# Altium project AMS_Remote_Module.PrjPcb
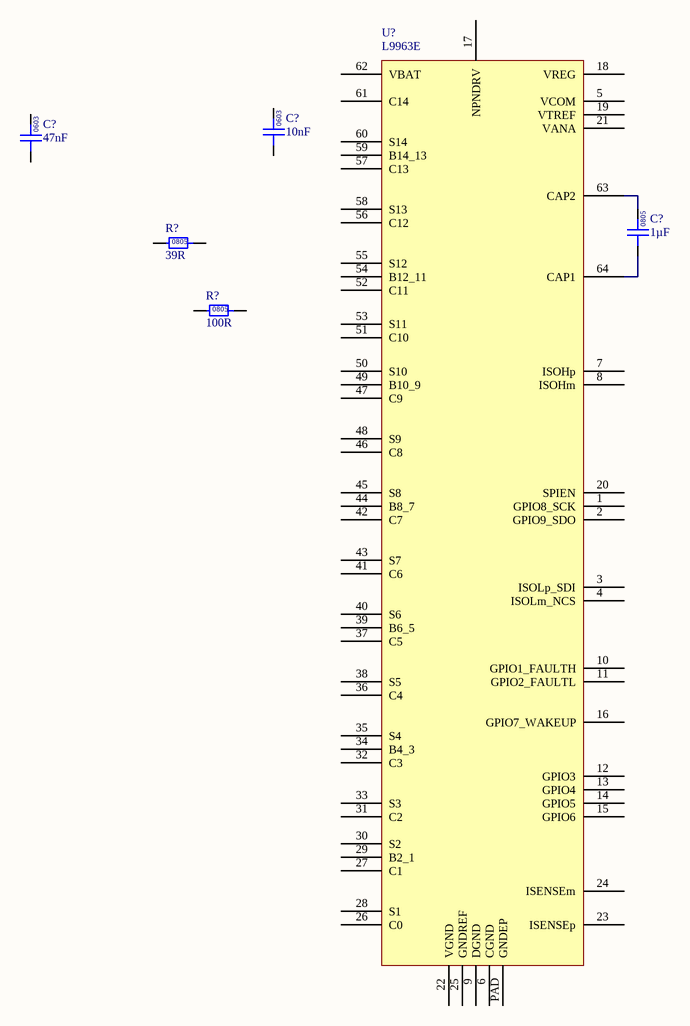
[diagram p0: L9663E.SchDoc]
1 sheet, 6 parts. Net scope: global (net labels, ports and power ports of the same name join across sheets).

## Sheet L9663E.SchDoc
size A3; SheetNumber: 1; SheetTotal: 1

### Parts
(Parts that share a designator on the sheet are numbered #1, #2 ... from top to bottom, then left to right.)
C?#1  47nF  [0603]
C?#2  10nF  [0603]
C?#3  1µF  [0805]
R?#1  39R  [0805]
R?#2  100R  [0805]
U?  L9963E  [ST_TQFP]

### Nets
NetC?#3_1: C?#3.1 U?.64(CAP1)
NetC?#3_2: C?#3.2 U?.63(CAP2)

Not connected (* = marked no-connect by the designer): C?#1 1 2; C?#2 1 2; R?#1 1 2; R?#2 1 2; U? 1(GPIO8_SCK) 2(GPIO9_SDO) 3(ISOLp_SDI) 4(ISOLm_NCS) 5(VCOM) 6(CGND) 7(ISOHp) 8(ISOHm) 9(DGND) 10(GPIO1_FAULTH) 11(GPIO2_FAULTL) 12(GPIO3) 13(GPIO4) 14(GPIO5) 15(GPIO6) 16(GPIO7_WAKEUP) 17(NPNDRV) 18(VREG) 19(VTREF) 20(SPIEN) 21(VANA) 22(VGND) 23(ISENSEp) 24(ISENSEm) 25(GNDREF) 26(C0) 27(C1) 28(S1) 29(B2_1) 30(S2) 31(C2) 32(C3) 33(S3) 34(B4_3) 35(S4) 36(C4) 37(C5) 38(S5) 39(B6_5) 40(S6) 41(C6) 42(C7) 43(S7) 44(B8_7) 45(S8) 46(C8) 47(C9) 48(S9) 49(B10_9) 50(S10) 51(C10) 52(C11) 53(S11) 54(B12_11) 55(S12) 56(C12) 57(C13) 58(S13) 59(B14_13) 60(S14) 61(C14) 62(VBAT) PAD(GNDEP)

### Notes on the sheet
- Section Leader Check:
- Date:
- Title:
- Revision
- Variant
- Project:
- Engineers:
- Sheet
- of
- (in symbol GCJ188R92A473KA01D) 0603
- (in symbol GCM21BR71H105KA03L) 0805
- (in symbol GCM188L81H103KA03D) 0603
- (in symbol RC0805FR0739RL) 0805
- (in symbol RC0805FR07100RL) 0805

### Library data of the parts
C?#1 = GCJ188R92A473KA01D: Manufacturer: Murata Electronics; Rated Voltage: 100V; Tolerance: ±10%; Material: MLCC; Temperature Rating: X8R; Part Number: GCJ188R92A473KA01D; Value: 47nF; Digikey Part Number: 490-16473-1-ND
C?#2 = GCM188L81H103KA03D: Manufacturer: muRata; Rated Voltage: 50V; Tolerance: ±10%; Material: MLCC; Temperature Rating: X8L; Part Number: GCM188L81H103KA03D; Value: 10nF; Digikey Part Number: 490-GCM188L81H103KA03DCT-ND
C?#3 = GCM21BR71H105KA03L: Manufacturer: muRata; Rated Voltage: 50V; Tolerance: ±10%; Material: MLCC; Temperature Rating: X7R; Part Number: GCM21BR71H105KA03L; Value: 1µF; Digikey Part Number: 490-10675-1-ND
R?#1 = RC0805FR0739RL: Manufacturer: YAGEO; Tolerance: 0.01; Rated Power: 0.125W; Part Number: RC0805FR0739RL; Value: 39R; Material: FR-07; Digikey Part Number: 311-39.0CRCT-ND
R?#2 = RC0805FR07100RL: Manufacturer: YAGEO; Tolerance: 0.01; Rated Power: 0.125W; Part Number: RC0805FR07100RL; Value: 100R; Material: FR-07; Digikey Part Number: 311-100CRCT-ND
U? = L9963E: AUTOMOTIVE CHIP FOR BATTERY MANA; Manufacturer: ST Microelectronics; Complex IC: 1; Part Number: L9963E